# Altium schematic sheet tree_io.leds.SchDoc
size A4
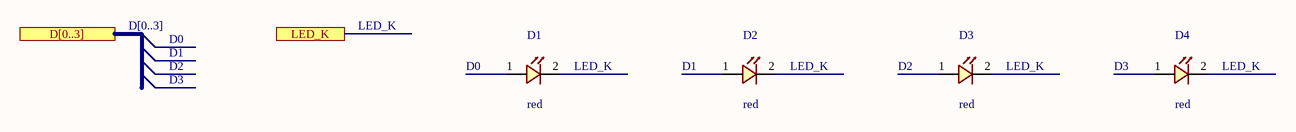
[diagram p0: tree_io.leds.SchDoc]

## Parts
D1  red  [LED0603]
D2  red  [LED0603]
D3  red  [LED0603]
D4  red  [LED0603]

## Ports
D[0..3], LED_K

## Nets
D0: D1.1(A)
D1: D2.1(A)
D2: D3.1(A)
D3: D4.1(A)
LED_K: D1.2(K) D2.2(K) D3.2(K) D4.2(K) ; port LED_K

## Buses and harness runs
bus D[0..3] = port D[0..3]

## Library data of the parts
D1-D4 = LED